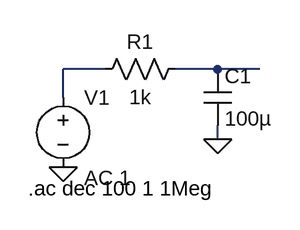
[diagram p0: schematic Test.asc]
Test.asc, the LTspice schematic file:
Version 4.1
SHEET 1 880 680
WIRE 144 32 96 32
WIRE 272 32 224 32
WIRE 320 32 272 32
WIRE 96 64 96 32
WIRE 272 112 272 96
FLAG 96 144 0
FLAG 272 112 0
SYMBOL voltage 96 48 R0
WINDOW 123 24 108 Left 2
WINDOW 39 0 0 Left 0
SYMATTR Value2 AC 1
SYMATTR InstName V1
SYMATTR Value ""
SYMBOL res 240 16 R90
WINDOW 0 0 56 VBottom 2
WINDOW 3 32 56 VTop 2
SYMATTR InstName R1
SYMATTR Value 1k
SYMBOL cap 256 32 R0
SYMATTR InstName C1
SYMATTR Value 100µ
TEXT 56 168 Left 2 !.ac dec 100 1 1Meg

The netlist it stands for:
* Test.asc
V1 N001 0 AC 1
R1 N002 N001 1k
C1 N002 0 100µ
.ac dec 100 1 1Meg
.backanno
.end